# EAGLE design controller-2 (EAGLE 9.2.2)
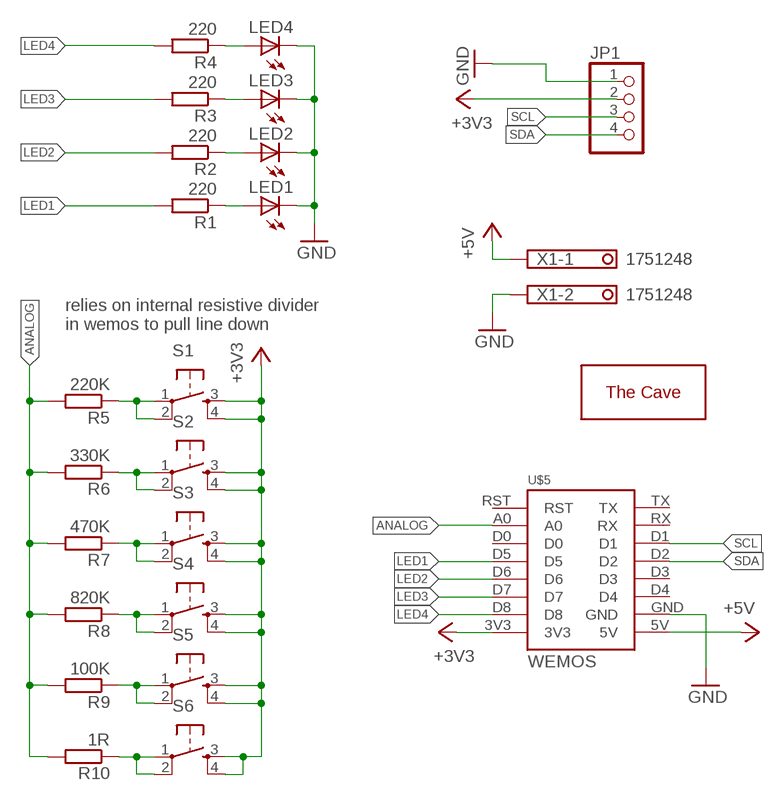
[diagram p0: schematic, sheet 1]

## Parts
JP1  PINHD-1X4  [1X04]
LED1  LED5MM  [LED5MM]
LED2  LED5MM  [LED5MM]
LED3  LED5MM  [LED5MM]
LED4  LED5MM  [LED5MM]
R1  220  R-EU_R0805  [R0805]
R2  220  R-EU_R0805  [R0805]
R3  220  R-EU_R0805  [R0805]
R4  220  R-EU_R0805  [R0805]
R5  220K  R-EU_R0805  [R0805]
R6  330K  R-EU_R0805  [R0805]
R7  470K  R-EU_R0805  [R0805]
R8  820K  R-EU_R0805  [R0805]
R9  100K  R-EU_R0805  [R0805]
R10  1R  R-EU_R0805  [R0805]
S1  TACT-SWITCH-6MM-THT  [TACT-SWITCH-6MM-THT]
S2  TACT-SWITCH-6MM-THT  [TACT-SWITCH-6MM-THT]
S3  TACT-SWITCH-6MM-THT  [TACT-SWITCH-6MM-THT]
S4  TACT-SWITCH-6MM-THT  [TACT-SWITCH-6MM-THT]
S5  TACT-SWITCH-6MM-THT  [TACT-SWITCH-6MM-THT]
S6  TACT-SWITCH-6MM-THT  [TACT-SWITCH-6MM-THT]
U$1  THECAVE_LOGO_NEW_TOP_SMALL  [NEW_LOGO_SMALL_TOP]
U$5  WEMOS  [WEMOS]
X1  1751248  [1751248]

## Nets
+3V3: JP1.2 S1.3 S1.4 S2.3 S2.4 S3.3 S3.4 S4.3 S4.4 S5.3 S5.4 S6.3 S6.4 U$5.3V3
+5V: U$5.5V X1.1
ANALOG: R5.2 R6.2 R7.2 R8.2 R9.2 R10.2 U$5.A0
GND: JP1.1 LED1.K(C) LED2.K(C) LED3.K(C) LED4.K(C) U$5.GND X1.2
LED1: R1.2 U$5.D5
LED2: R2.2 U$5.D6
LED3: R3.2 U$5.D7
LED4: R4.2 U$5.D8
N$1: LED4.A R4.1
N$3: LED3.A R3.1
N$4: LED2.A R2.1
N$5: LED1.A R1.1
N$6: R10.1 S6.1 S6.2
N$8: R9.1 S5.1 S5.2
N$9: R8.1 S4.1 S4.2
N$11: R7.1 S3.1 S3.2
N$12: R6.1 S2.1 S2.2
N$14: R5.1 S1.1 S1.2
SCL: JP1.3 U$5.D1
SDA: JP1.4 U$5.D2
Unconnected: U$5.D0 U$5.D3 U$5.D4 U$5.RST U$5.RX U$5.TX

## Notes on the sheet
- relies on internal resistive divider 
  in wemos to pull line down

## Library data of the parts
JP1 = pinhead:PINHD-1X4: PIN HEADER
LED1-LED4 = led:LED: LED OSRAM: - CHIPLED LG R971, LG N971, LY N971, LG Q971, LY Q971, LO R971, LY R971 LH N974, LH R974 LS Q976, LO Q976, LY Q976 LO Q996 - Hyper CHIPLED LW Q18S LB Q993, LB Q99A, LB R99A - SideLED LS A670, LO A670, LY A670, LG A670, LP A670 LB A673, LV A673, LT A673, LW A673 LH A674 LY A675 LS A676, LA A676, LO A676, LY A676, LW A676 LS A679, LY A679, LG A679 - Hyper Micro SIDELED® LS Y876, LA Y876, LO Y876, LY Y876 LT Y87S - SmartLED LW L88C, LW L88S LB L89C, LB L89S, LG L890 LS L89K, LO L89K, LY L89K LS L896, LA L896, LO L896, LY L896 - TOPLED LS T670, LO T670, LY T670, LG T670, LP T670 LSG T670, LSP T670, LSY T670, LOP T670, LYG T670 LG T671, LOG T671, LSG T671 LB T673, LV T673, LT T673, LW T673 LH T674 LS T676, LA T676, LO T676, LY T676, LB T676, LH T676, LSB T676, LW T676 LB T67C, LV T67C, LT T67C, LS T67K, LO T67K, LY T67K, LW E67C LS E67B, LA E67B, LO E67B, LY E67B, LB E67C, LV E67C, LT E67C LW T67C LS T679, LY T679, LG T679 LS T770, LO T770, LY T770, LG T770, LP T770 LB T773, LV T773, LT T773, LW T773 LH T774 LS E675, LA E675, LY E675, LS T675 LS T776, LA T776, LO T776, LY T776, LB T776 LHGB T686 LT T68C, LB T68C - Hyper Mini TOPLED® LB M676 - Mini TOPLED Santana® LG M470 LS M47K, LO M47K, LY M47K Source: http://www.osram.convergy.de LUXEON: - LUMILED® LXK2-PW12-R00, LXK2-PW12-S00, LXK2-PW14-U00, LXK2-PW14-V00 LXK2-PM12-R00, LXK2-PM12-S00, LXK2-PM14-U00 LXK2-PE12-Q00, LXK2-PE12-R00, LXK2-PE12-S00, LXK2-PE14-T00, LXK2-PE14-U00 LXK2-PB12-K00, LXK2-PB12-L00, LXK2-PB12-M00, LXK2-PB14-N00, LXK2-PB14-P00, LXK2-PB14-Q00 LXK2-PR12-L00, LXK2-PR12-M00, LXK2-PR14-Q00, LXK2-PR14-R00 LXK2-PD12-Q00, LXK2-PD12-R00, LXK2-PD12-S00 LXK2-PH12-R00, LXK2-PH12-S00 LXK2-PL12-P00, LXK2-PL12-Q00, LXK2-PL12-R00 Source: www.luxeon.com KINGBRIGHT: KA-3528ASYC Source: www.kingbright.com
R1-R10 = rcl:R-EU_: RESISTOR, European symbol; SPICEPREFIX: R
S1-S6 = thecave:TACT-SWITCH-6MM
U$1 = thecave:THECAVE_LOGO: The Cave DIY workshop logos thecave.cz
U$5 = d1-mini:WEMOS
X1 = con-phoenix-350:1751248: MKDS 1/ 2-3,5 Printklemme Nennstrom: 10 A Bemessungsspannung: 160 V Raster: 3,5 mm Polzahl: 2 Montageart: Löten Anschlussart: Schraubanschluss Anschlussrichtung vom Leiter zur Platine: 0° Source: http://eshop.phoenixcontact.com .. 1751248.pdf; OC_FARNELL: unknown; OC_NEWARK: unknown

## Board
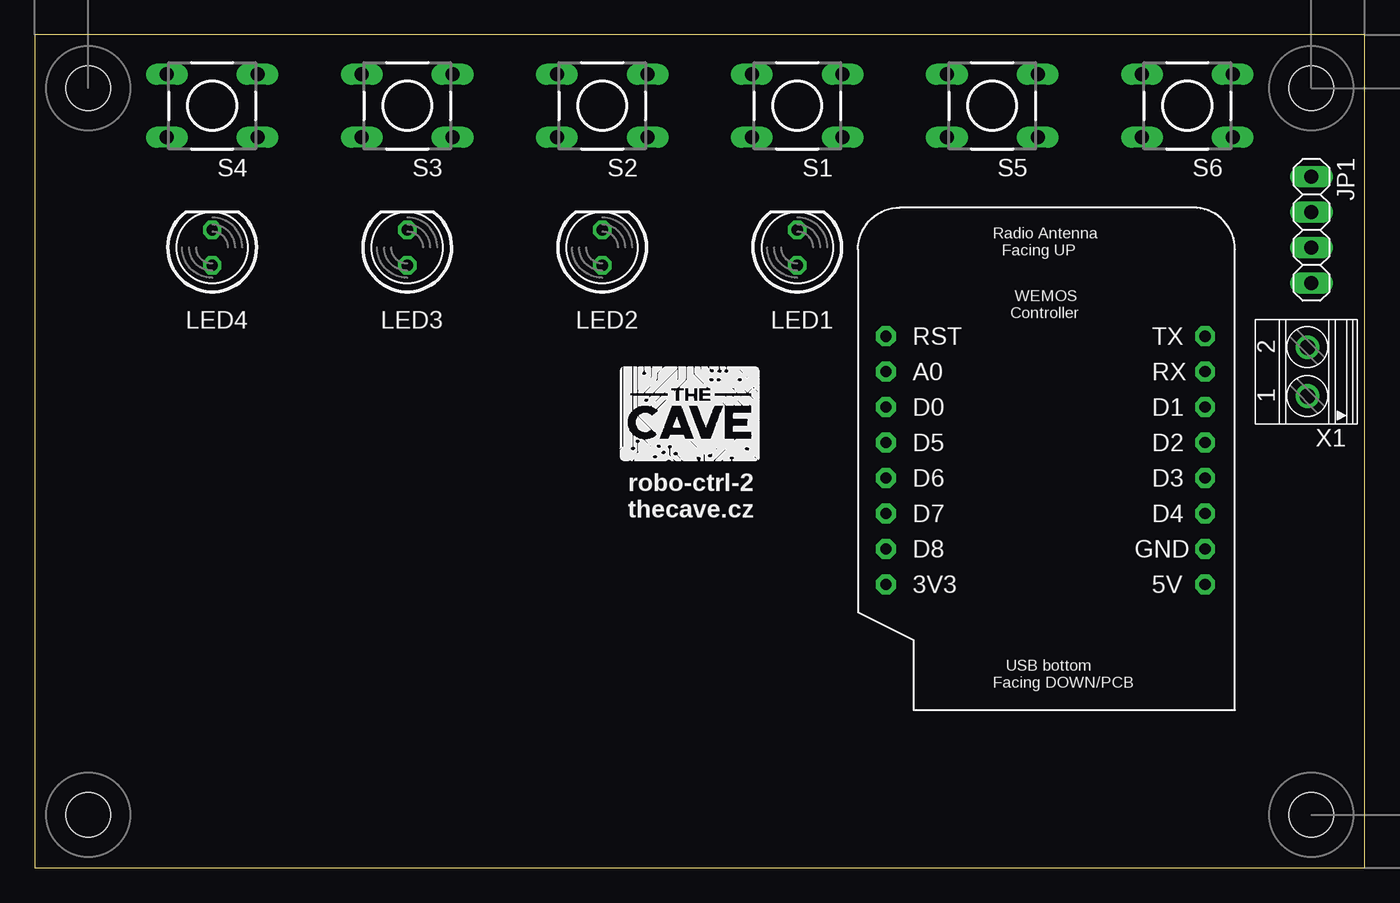
[diagram p1: board, top side]
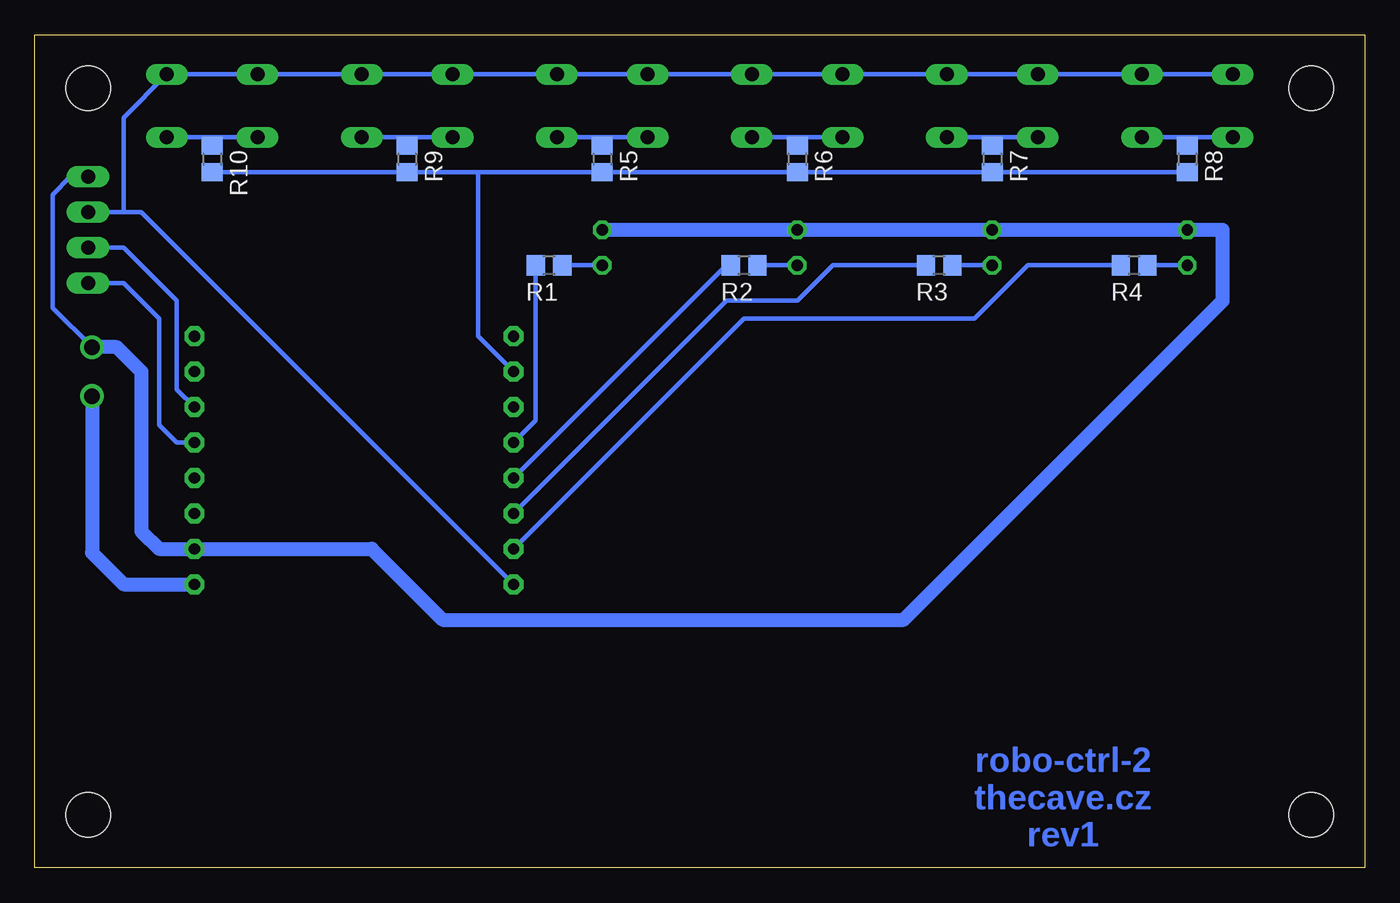
[diagram p2: board, bottom side, seen from below]

Size 95.25 x 59.69 mm. Coordinates in mm from the lower left corner, seen from the top.
Outline: 0,0 95.25,0 95.25,59.69 0,59.69 0,0
Copper layers (1*16): Top 0.035mm / dielectric 1.5mm / Bottom 0.035mm
Design rules "default *": minimum track width 10mil, minimum drill 0.5mm, track to track 10mil, track to pad 10mil, pad to pad 10mil, via to via 10mil, smd to smd 10mil, copper to edge 24mil, drill to drill 10mil, minimum pad ring 10mil, minimum via ring 8mil, stop-mask expansion 4mil, vias tented up to drill 0mil, thermal gap 10mil
Holes 3.2 mm at 3.81,55.88 3.81,3.81 91.44,55.88 91.44,3.81

### Footprints (pad centres in the part's own frame; a part is rotated, then mirrored left to right if it is on the bottom)
1X04 = drill 1.016 long: 1 -3.81,0; 2 -1.27,0; 3 1.27,0; 4 3.81,0
LED5MM = drill 0.813 octagon: A -1.27,0; K 1.27,0
R0805 = smd 1.3 x 1.5: 1 -0.95,0; 2 0.95,0
TACT-SWITCH-6MM-THT = drill 1 long: 1 -3.25,2.25; 2 3.25,2.25; 3 -3.25,-2.25; 4 3.25,-2.25
WEMOS = drill 0.8 pad 1.422 octagon: 3V3 0,0; 5V 22.86,0; A0 0,15.24; D0 0,12.7; D1 22.86,12.7; D2 22.86,10.16; D3 22.86,7.62; D4 22.86,5.08; D5 0,10.16; D6 0,7.62; D7 0,5.08; D8 0,2.54; GND 22.86,2.54; RST 0,17.78; RX 22.86,15.24; TX 22.86,17.78
1751248 = drill 1.1 pad 1.7: 1 -1.75,-0.1; 2 1.75,-0.1

### Placement (x,y rotation side)
JP1  91.44,45.72 270 top
LED1  54.61,44.45 90 top
LED2  40.64,44.45 90 top
LED3  26.67,44.45 90 top
LED4  12.7,44.45 90 top
R1  58.42,43.18 180 bottom
R2  44.45,43.18 180 bottom
R3  30.48,43.18 180 bottom
R4  16.51,43.18 180 bottom
R5  54.61,50.8 270 bottom
R6  40.64,50.8 270 bottom
R7  26.67,50.8 270 bottom
R8  12.7,50.8 270 bottom
R9  68.58,50.8 270 bottom
R10  82.55,50.8 270 bottom
S1  54.61,54.61 180 top
S2  40.64,54.61 180 top
S3  26.67,54.61 180 top
S4  12.7,54.61 180 top
S5  68.58,54.61 180 top
S6  82.55,54.61 180 top
U$1  41.91,29.21 0 top
U$5  60.96,20.32 0 top
X1  91.06,35.56 90 top

### Tracks (layer width: path | path; a pad name or v marks a point on that pad's centre or on a via)
+3V3
  Bottom 0.305: S4.4 S4.3 S3.4 S3.3 S2.4 S2.3 S1.4 S1.3 S5.4 S5.3 S6.4 S6.3 88.9,53.76 88.9,46.99 | U$5.3V3 87.63,46.99 88.9,46.99 | 88.9,46.99 JP1.2
+5V
  Bottom 1.016: U$5.5V 88.9,20.32 91.16,22.58 X1.1
ANALOG
  Bottom 0.305: R8.2 R7.2 R6.2 R5.2 63.5,49.85 | 63.5,49.85 R9.2 R10.2 | U$5.A0 63.5,38.1 63.5,49.85
GND
  Bottom 0.305: JP1.1 92.71,49.53 93.98,48.26 93.98,40.13 X1.2
  Bottom 1.016: LED1.K LED2.K LED3.K LED4.K 10.16,45.72 10.16,40.64 33.02,17.78 66.04,17.78 71.12,22.86 U$5.GND 86.36,22.86 87.63,24.13 87.63,35.56 89.38,37.31 X1.2
LED1
  Bottom 0.305: U$5.D5 59.37,32.07 R1.2
LED2
  Bottom 0.305: U$5.D6 45.72,43.18 R2.2
LED3
  Bottom 0.305: R3.2 38.1,43.18 40.64,40.64 45.72,40.64 U$5.D7
LED4
  Bottom 0.305: R4.2 24.13,43.18 27.94,39.37 44.45,39.37 U$5.D8
N$1
  Bottom 0.305: LED4.A R4.1
N$3
  Bottom 0.305: LED3.A R3.1
N$4
  Bottom 0.305: LED2.A R2.1
N$5
  Bottom 0.305: LED1.A R1.1
N$6
  Bottom 0.305: S6.2 82.55,52.36 | 82.55,52.36 S6.1 | R10.1 82.55,52.36
N$8
  Bottom 0.305: S5.2 68.58,52.36 | 68.58,52.36 S5.1 | R9.1 68.58,52.36
N$9
  Bottom 0.305: S4.2 12.7,52.36 | 12.7,52.36 S4.1 | R8.1 12.7,52.36
N$11
  Bottom 0.305: S3.2 26.67,52.36 | 26.67,52.36 S3.1 | R7.1 26.67,52.36
N$12
  Bottom 0.305: S2.2 40.64,52.36 | 40.64,52.36 S2.1 | R6.1 40.64,52.36
N$14
  Bottom 0.305: S1.2 54.61,52.36 | 54.61,52.36 S1.1 | R5.1 54.61,52.36
SCL
  Bottom 0.305: U$5.D1 85.09,34.29 85.09,40.64 88.9,44.45 JP1.3
SDA
  Bottom 0.305: U$5.D2 85.09,30.48 86.36,31.75 86.36,39.37 88.9,41.91 JP1.4

### Text on the board
Bottom: robo-ctrl-2 / thecave.cz / rev1
tPlace: robo-ctrl-2 / thecave.cz